# EAGLE schematic ADCBreakout (EAGLE 6.5.0)

## Sheet 1 of 2
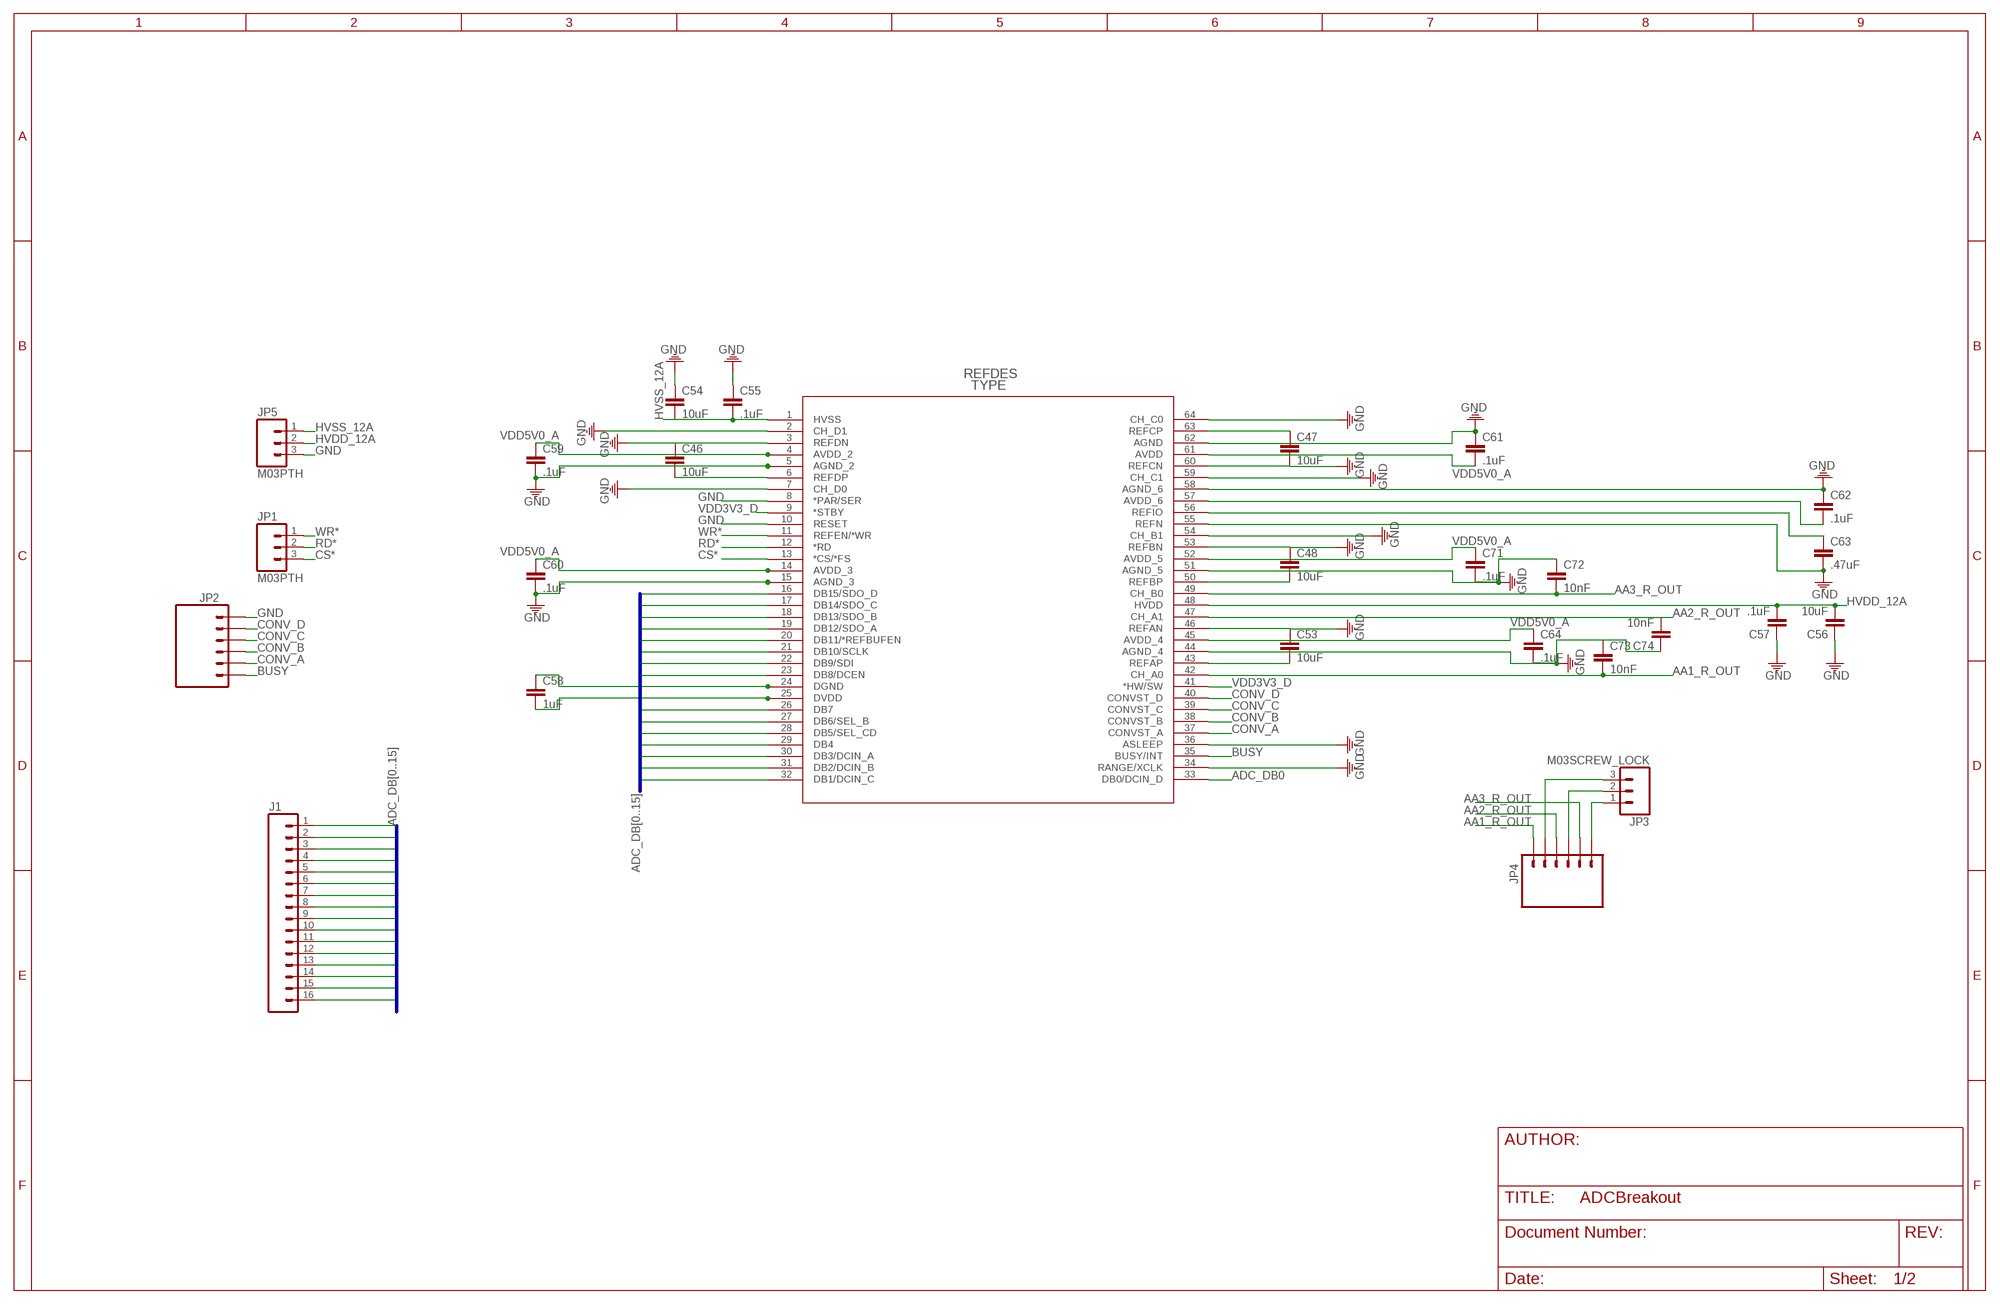
[diagram p0: schematic, sheet 1]

### Parts
C46  10uF  CAP0805  [0805]
C47  10uF  CAP0805  [0805]
C48  10uF  CAP0805  [0805]
C53  10uF  CAP0805  [0805]
C54  10uF  CAP0805  [0805]
C55  .1uF  CAP0805  [0805]
C56  10uF  CAP0805  [0805]
C57  .1uF  CAP0805  [0805]
C58  1uF  CAP0805  [0805]
C59  .1uF  CAP0805  [0805]
C60  .1uF  CAP0805  [0805]
C61  .1uF  CAP0805  [0805]
C62  .1uF  CAP0805  [0805]
C63  .47uF  CAP0805  [0805]
C64  .1uF  CAP0805  [0805]
C71  .1uF  CAP0805  [0805]
C72  10nF  CAP0805  [0805]
C73  10nF  CAP0805  [0805]
C74  10nF  CAP0805  [0805]
J1  M16PTH  [1X16]
JP1  M03PTH  [1X03]
JP2  M06SIP  [1X06]
JP3  M03SCREW_LOCK  [SCREWTERMINAL-3.5MM-3_LOCK.007S]
JP4  M06SIP  [1X06]
JP5  M03PTH  [1X03]
U1  ADS8568_PM_64  [PM64]

### Nets
AA1_R_OUT: C73.2 JP4.1 U1.42(CH_A0)
AA2_R_OUT: C74.2 JP4.3 U1.47(CH_A1)
AA3_R_OUT: C72.2 JP4.5 U1.49(CH_B0)
ADC_DB0: J1.1 U1.33(DB0/DCIN_D)
ADC_DB1: J1.2 U1.32(DB1/DCIN_C)
ADC_DB2: J1.3 U1.31(DB2/DCIN_B)
ADC_DB3: J1.4 U1.30(DB3/DCIN_A)
ADC_DB4: J1.5 U1.29(DB4)
ADC_DB5: J1.6 U1.28(DB5/SEL_CD)
ADC_DB6: J1.7 U1.27(DB6/SEL_B)
ADC_DB7: J1.8 U1.26(DB7)
ADC_DB8: J1.9 U1.23(DB8/DCEN)
ADC_DB9: J1.10 U1.22(DB9/SDI)
ADC_DB10: J1.11 U1.21(DB10/SCLK)
ADC_DB11: J1.12 U1.20(DB11/*REFBUFEN)
ADC_DB12: J1.13 U1.19(DB12/SDO_A)
ADC_DB13: J1.14 U1.18(DB13/SDO_B)
ADC_DB14: J1.15 U1.17(DB14/SDO_C)
ADC_DB15: J1.16 U1.16(DB15/SDO_D)
BUSY: JP2.6 U1.35(BUSY/INT)
CONV_A: JP2.5 U1.37(CONVST_A)
CONV_B: JP2.4 U1.38(CONVST_B)
CONV_C: JP2.3 U1.39(CONVST_C)
CONV_D: JP2.2 U1.40(CONVST_D)
CS*: JP1.3 U1.13(*CS/*FS)
GND: C46.1 C47.2 C48.1 C53.1 C54.1 C55.1 C56.1 C57.1 C58.1 C59.2 C60.2 C61.1 C62.1 C63.2 C64.2 C71.2 C72.1 C73.1 C74.1 JP2.1 JP5.3 U1.2(CH_D1) U1.3(REFDN) U1.5(AGND_2) U1.7(CH_D0) U1.8(*PAR/SER) U1.10(RESET) U1.15(AGND_3) U1.24(DGND) U1.34(RANGE/XCLK) U1.36(ASLEEP) U1.44(AGND_4) U1.46(REFAN) U1.51(AGND_5) U1.53(REFBN) U1.54(CH_B1) U1.55(REFN) U1.58(AGND_6) U1.59(CH_C1) U1.60(REFCN) U1.62(AGND) U1.64(CH_C0) ; also sheet 2
HVDD_12A: C56.2 C57.2 JP5.2 U1.48(HVDD) ; also sheet 2
HVSS_12A: C54.2 C55.2 JP5.1 U1.1(HVSS)
N$1: JP3.3 JP4.2
N$2: JP3.2 JP4.4
N$3: JP3.1 JP4.6
N$7: C63.1 U1.56(REFIO)
N$87: C46.2 U1.6(REFDP)
N$93: C53.2 U1.43(REFAP)
N$94: C48.2 U1.50(REFBP)
N$96: C47.1 U1.63(REFCP)
RD*: JP1.2 U1.12(*RD)
VDD3V3_D: C58.2 U1.9(*STBY) U1.25(DVDD) U1.41(*HW/SW) ; also sheet 2
VDD5V0_A: C59.1 C60.1 C61.2 C62.2 C64.1 C71.1 U1.4(AVDD_2) U1.14(AVDD_3) U1.45(AVDD_4) U1.52(AVDD_5) U1.57(AVDD_6) U1.61(AVDD) ; also sheet 2
WR*: JP1.1 U1.11(REFEN/*WR)

### Buses
ADC_DB[0..15]

## Sheet 2 of 2
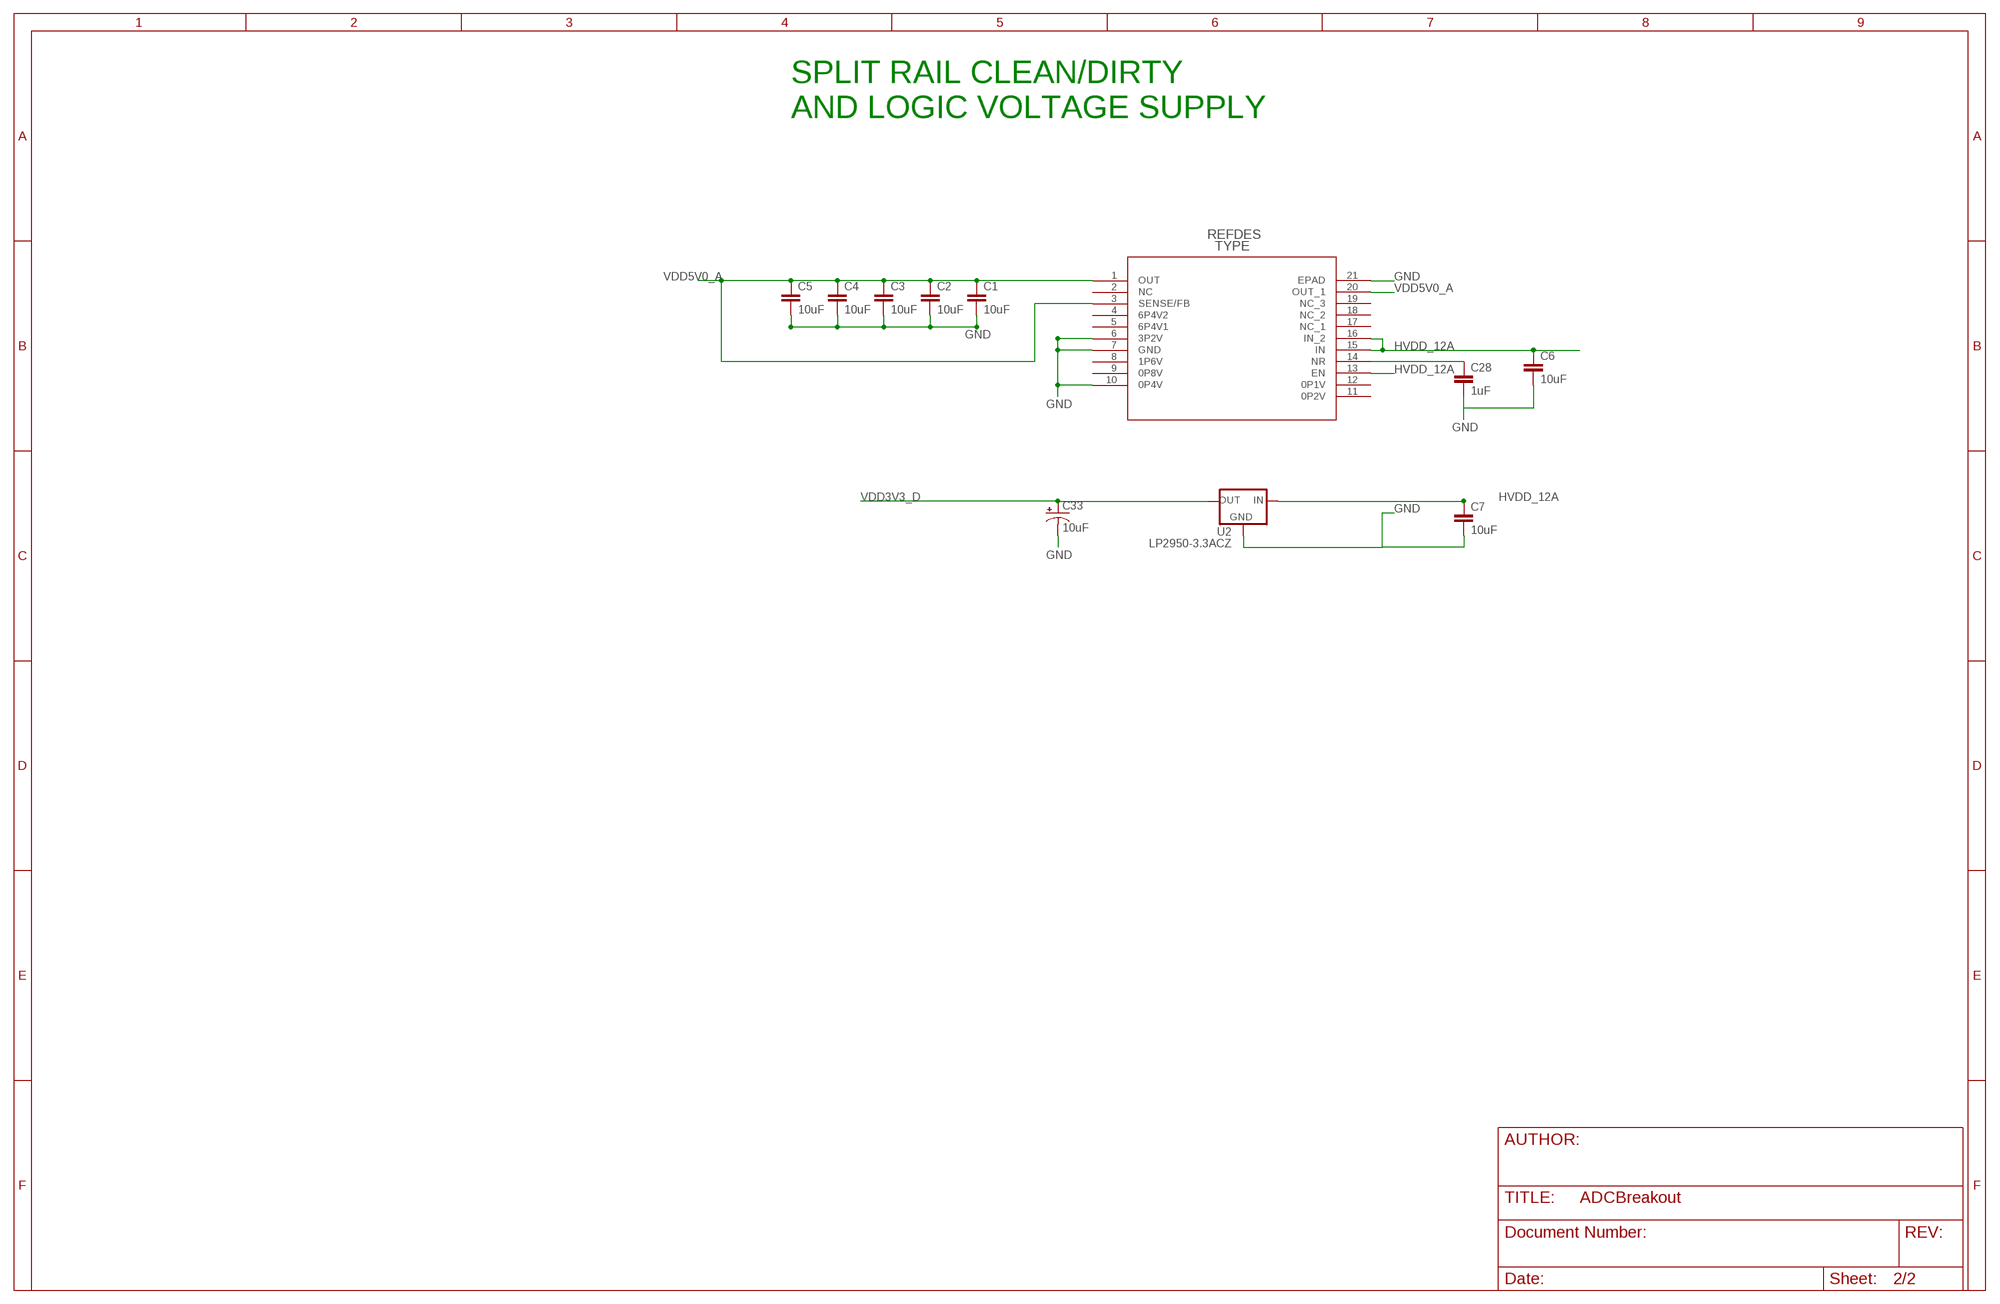
[diagram p1: schematic, sheet 2]

### Parts
C1  10uF  CAP0805  [0805]
C2  10uF  CAP0805  [0805]
C3  10uF  CAP0805  [0805]
C4  10uF  CAP0805  [0805]
C5  10uF  CAP0805  [0805]
C6  10uF  CAP0805  [0805]
C7  10uF  CAP0805  [0805]
C28  1uF  CAP0805  [0805]
C33  10uF  CAP_POLPTH2  [CPOL-RADIAL-10UF-25V]
U2  LP2950-3.3ACZ  [TO92]
U$3  TPS7A4700_RGW_20  [RGW20_3P15X3P15]

### Nets
GND: C1.2 C2.2 C3.2 C4.2 C5.2 C6.2 C7.2 C28.2 C33.2(-) U2.2(GND) U$3.6(3P2V) U$3.7(GND) U$3.10(0P4V) U$3.21(EPAD) ; also sheet 1
HVDD_12A: C6.1 C7.1 U2.3(IN) U$3.13(EN) U$3.15(IN) U$3.16(IN_2) ; also sheet 1
N$45: C28.1 U$3.14(NR)
VDD3V3_D: C33.1(+) U2.1(OUT) ; also sheet 1
VDD5V0_A: C1.1 C2.1 C3.1 C4.1 C5.1 U$3.1(OUT) U$3.3(SENSE/FB) U$3.20(OUT_1) ; also sheet 1
Unconnected: U$3.2(NC) U$3.4(6P4V2) U$3.5(6P4V1) U$3.8(1P6V) U$3.9(0P8V) U$3.11(0P2V) U$3.12(0P1V) U$3.17(NC_1) U$3.18(NC_2) U$3.19(NC_3)

### Notes on the sheet
- SPLIT RAIL CLEAN/DIRTY
  AND LOGIC VOLTAGE SUPPLY

## Library data of the parts
C1-C7 C28 C46-C48 C53-C64 C71-C74 = SensorCape:CAP: Capacitor Standard 0603 ceramic capacitor, and 0.1" leaded capacitor.
C33 = SensorCape:CAP_POL: Capacitor Polarized These are standard SMD and PTH capacitors. Normally 10uF, 47uF, and 100uF in electrolytic and tantalum varieties. Always verify the external diameter of the through hole cap, it varies with capacity, voltage, and manufacturer. The EIA devices should be standard.
J1 = ASL:M16: Header 16 Standard 16-pin 0.1" header. Male version: taken from http://search.digikey.com/scripts/DkSearch/dksus.dll?Detail&name=SAM1034-50-ND Female Version:
JP1 JP3 JP5 = ASL:M03: Header 3 Standard 3-pin 0.1" header. Use with straight break away headers (SKU : PRT-00116), right angle break away headers (PRT-00553), swiss pins (PRT-00743), machine pins (PRT-00117), and female headers (PRT-00115). Molex polarized connector foot print use with SKU : PRT-08232 with associated crimp pins and housings.
JP2 JP4 = ASL:M06: Header 6 Standard 6-pin 0.1" header. Use with straight break away headers (SKU : PRT-00116), right angle break away headers (PRT-00553), swiss pins (PRT-00743), machine pins (PRT-00117), and female headers (PRT-00115). Molex polarized connector foot print use with SKU : PRT-08094 with associated crimp pins and housings. NOTES ON THE VARIANTS LOCK and LOCK_LONGPADS... This footprint was designed to help hold the alignment of a through-hole component (i.e. 6-pin header) while soldering it into place. You may notice that each hole has been shifted either up or down by 0.005 of an inch from it's more standard position (which is a perfectly straight line). This slight alteration caused the pins (the squares in the middle) to touch the edges of the holes. Because they are alternating, it causes a "brace" to hold the component in place. 0.005 has proven to be the perfect amount of "off-center" position when using our standard breakaway headers. Although looks a little odd when you look at the bare footprint, once you have a header in there, the alteration is very hard to notice. Also, if you push a header all the way into place, it is covered up entirely on the bottom side. This idea of altering the position of holes to aid alignment will be further integrated into the Sparkfun Library for other footprints. It can help hold any component with 3 or more connection pins.
U1 = SensorCape:ADS8568_PM_64
U2 = ASL:LP2950: Source: http://cache.national.com/ds/LP/LP2950.pdf
U$3 = SensorCape:TPS7A4700_RGW_20